# Altium schematic sheet sketch.SchDoc
size A
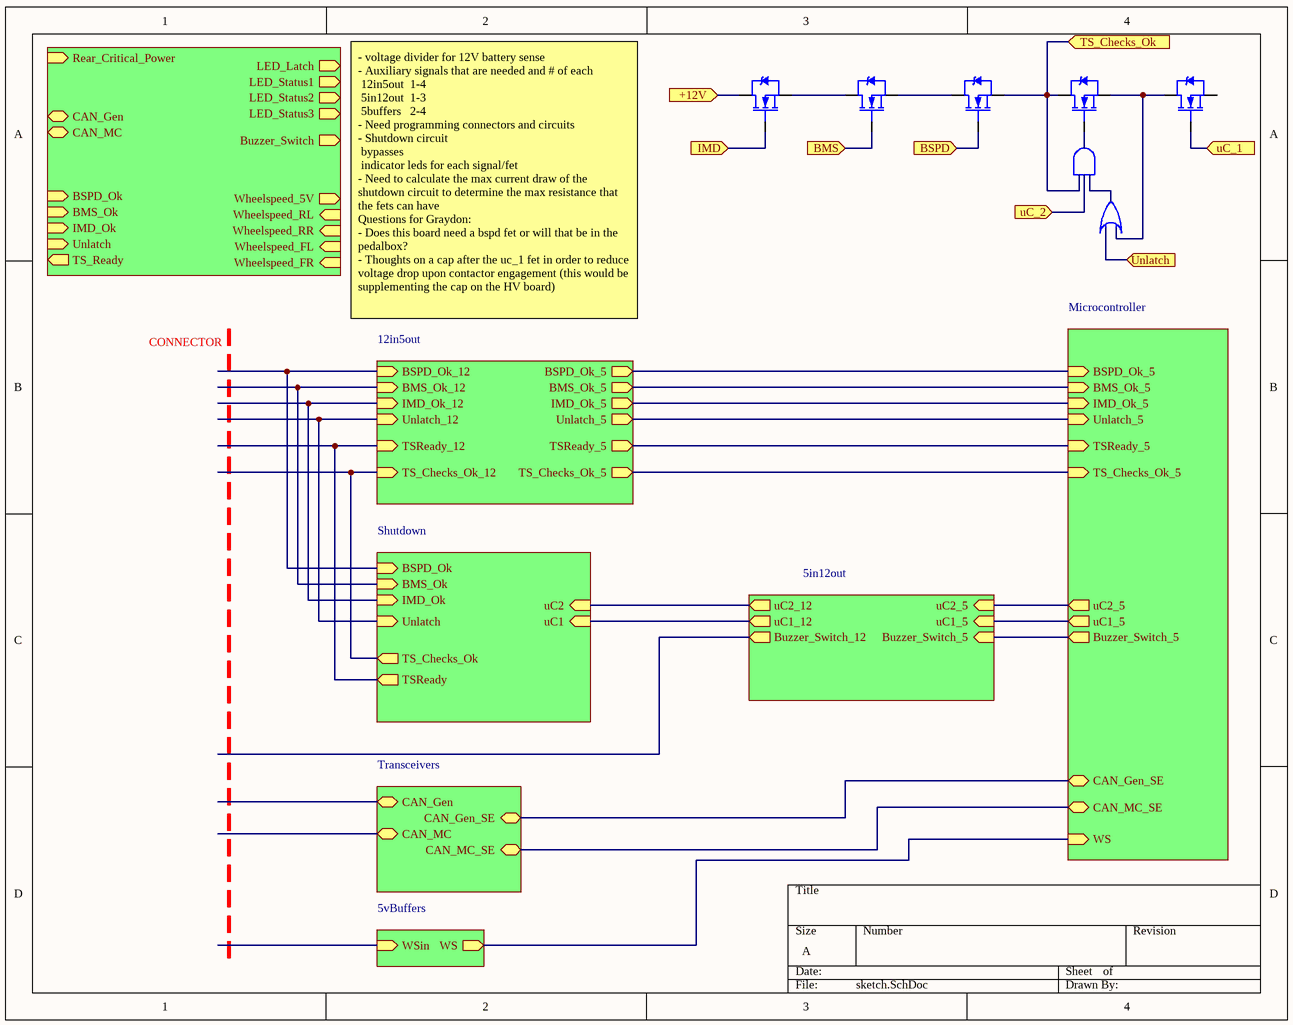
[diagram p0: sketch.SchDoc]

## Parts
(Parts that share a designator on the sheet are numbered #1, #2 ... from top to bottom, then left to right.)
M?#1  PSMN2R2-25YLC  [POWER-SO8]  (value not drawn)
M?#2  PSMN2R2-25YLC  [POWER-SO8]  (value not drawn)
M?#3  PSMN2R2-25YLC  [POWER-SO8]  (value not drawn)
M?#4  PSMN2R2-25YLC  [POWER-SO8]  (value not drawn)
M?#5  PSMN2R2-25YLC  [POWER-SO8]  (value not drawn)

## Sub-sheets
5in12out = ?: uC2_5 (in), uC1_5 (in), uC2_12 (out), uC1_12 (out), Buzzer_Switch_5 (in), Buzzer_Switch_12 (out)
5vBuffers = ?: WSin (in), WS (out)
12in5out = ?: BSPD_Ok_12 (in), BMS_Ok_12 (in), IMD_Ok_12 (in), Unlatch_12 (in), TSReady_12 (in), BSPD_Ok_5 (out), BMS_Ok_5 (out), IMD_Ok_5 (out), Unlatch_5 (out), TSReady_5 (out), TS_Checks_Ok_12 (in), TS_Checks_Ok_5 (out)
Microcontroller = ?: BSPD_Ok_5 (in), BMS_Ok_5 (in), IMD_Ok_5 (in), Unlatch_5 (in), TSReady_5 (in), TS_Checks_Ok_5 (in), uC2_5 (out), uC1_5 (out), Buzzer_Switch_5 (out), CAN_Gen_SE (bidir), CAN_MC_SE (bidir), WS (in)
Shutdown = ?: BSPD_Ok (in), BMS_Ok (in), IMD_Ok (in), TSReady (out), uC2 (in), uC1 (in), TS_Checks_Ok (out), Unlatch (in)
Transceivers = ?: CAN_Gen (bidir), CAN_Gen_SE (bidir), CAN_MC (bidir), CAN_MC_SE (bidir)
? = ?: CAN_Gen (bidir), CAN_MC (bidir), Wheelspeed_FR (in), Wheelspeed_FL (in), Wheelspeed_RR (in), Wheelspeed_RL (in), BSPD_Ok (in), LED_Latch (out), LED_Status1 (out), LED_Status2 (out), LED_Status3 (out), BMS_Ok (in), IMD_Ok (in), Unlatch (in), Buzzer_Switch (out), TS_Ready (out), Rear_Critical_Power (in), Wheelspeed_5V (out)

## Ports
+12V (in), BMS (in), BSPD (in), IMD (in), TS_Checks_Ok (in), uC_1 (in), uC_2 (in), Unlatch (in)

## Nets
+12V: M?#1.D(Drain) ; port +12V
BMS: M?#2.G(Gate) ; port BMS
BSPD: M?#3.G(Gate) ; port BSPD
IMD: M?#1.G(Gate) ; port IMD
TS_Checks_Ok: M?#3.S(Source) M?#4.D(Drain) ; port TS_Checks_Ok
uC_1: M?#5.G(Gate) ; port uC_1
NetM?#1_S: M?#1.S(Source) M?#2.D(Drain)
NetM?#2_S: M?#2.S(Source) M?#3.D(Drain)
NetM?#4_S: M?#4.S(Source) M?#5.D(Drain)
(unnamed): sheet 12in5out/BSPD_Ok_12, sheet Shutdown/BSPD_Ok
(unnamed): sheet 12in5out/BMS_Ok_12, sheet Shutdown/BMS_Ok
(unnamed): sheet 12in5out/IMD_Ok_12, sheet Shutdown/IMD_Ok
(unnamed): sheet 12in5out/Unlatch_12, sheet Shutdown/Unlatch
(unnamed): sheet 12in5out/TSReady_12, sheet Shutdown/TSReady
(unnamed): sheet 12in5out/BSPD_Ok_5, sheet Microcontroller/BSPD_Ok_5
(unnamed): sheet 12in5out/BMS_Ok_5, sheet Microcontroller/BMS_Ok_5
(unnamed): sheet 12in5out/IMD_Ok_5, sheet Microcontroller/IMD_Ok_5
(unnamed): sheet 12in5out/Unlatch_5, sheet Microcontroller/Unlatch_5
(unnamed): sheet 12in5out/TSReady_5, sheet Microcontroller/TSReady_5
(unnamed): sheet 12in5out/TS_Checks_Ok_12, sheet Shutdown/TS_Checks_Ok
(unnamed): sheet 12in5out/TS_Checks_Ok_5, sheet Microcontroller/TS_Checks_Ok_5
(unnamed): sheet Shutdown/uC2, sheet 5in12out/uC2_12
(unnamed): sheet Shutdown/uC1, sheet 5in12out/uC1_12
(unnamed): sheet 5in12out/uC2_5, sheet Microcontroller/uC2_5
(unnamed): sheet 5in12out/uC1_5, sheet Microcontroller/uC1_5
(unnamed): sheet 5in12out/Buzzer_Switch_5, sheet Microcontroller/Buzzer_Switch_5
(unnamed): sheet Transceivers/CAN_Gen_SE, sheet Microcontroller/CAN_Gen_SE
(unnamed): sheet Transceivers/CAN_MC_SE, sheet Microcontroller/CAN_MC_SE
(unnamed): sheet 5vBuffers/WS, sheet Microcontroller/WS

Not connected (* = marked no-connect by the designer): M?#4 G(Gate); M?#5 S(Source)

## Notes on the sheet
- CONNECTOR
- - voltage divider for 12V battery sense
  - Auxiliary signals that are needed and # of each
  12in5out  1-4
  5in12out  1-3
  5buffers   2-4
  - Need programming connectors and circuits
  - Shutdown circuit
  bypasses
  indicator leds for each signal/fet
  - Need to calculate the max current draw of the shutdown circuit to determine the max resistance that the fets can have
  Questions for Graydon:
  - Does this board need a bspd fet or will that be in the pedalbox?
  - Thoughts on a cap after the uc_1 fet in order to reduce voltage drop upon contactor engagement (this would be supplementing the cap on the HV board)

## Library data of the parts
M?#1-M?#5 = 3: N-Channel 25V 100A (Tc) 106W (Tc) Surface Mount LFPAK56, Power-SO8; id: 3; vdsmax: 0; numcircuits: 1; rdson: 2.5mOhm; vt: 4.5; vgsmax: 20; MfrPartNo: *; name: PSMN2R2-25YLC; type: N_Channel; current: 100A; package: LFPAK56; quantity: 0; link: https://www.digikey.com/product-detail/en/nexperia-usa-inc/PSMN2R2-25YLC115/1727-5299-1-ND/2674299